# Altium schematic sheet BopIt.SchDoc
size A; SheetNumber: 1; SheetTotal: 1
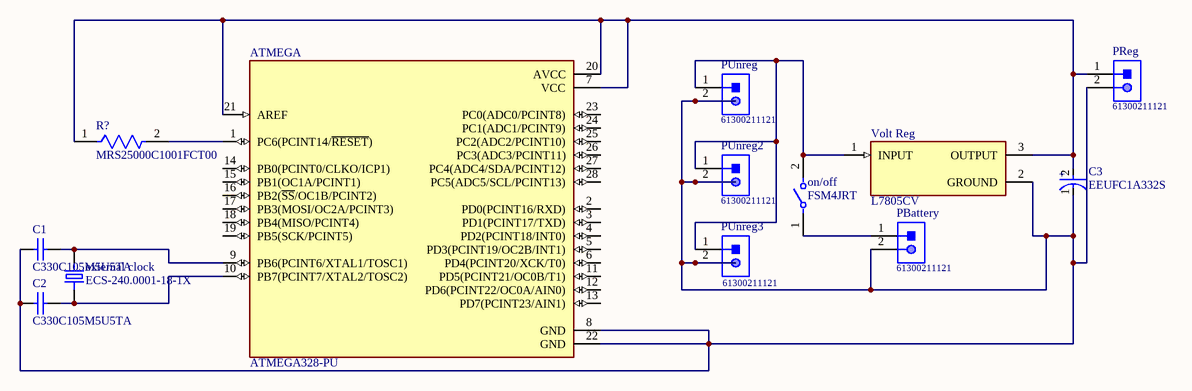
[diagram p0: BopIt.SchDoc]

## Parts
ATMEGA  ATMEGA328-PU  [DIP787W46P254L3467H508Q28]
C1  C330C105M5U5TA  [KEMT-C330C105M5U5TA]
C2  C330C105M5U5TA  [KEMT-C330C105M5U5TA]
C3  EEUFC1A332S  [FP-RAD-TH-D_16_0_5-L_20_2-MFG]
external_clock  ECS-240.0001-18-1X  [XTAL_ECS-200-20-1X]
on/off  FSM4JRT  [FP-FSM4JRT-MFG]
PBattery  61300211121  [61300211121]
PReg  61300211121  [61300211121]
PUnreg  61300211121  [61300211121]
PUnreg2  61300211121  [61300211121]
PUnreg3  61300211121  [61300211121]
R?  MRS25000C1001FCT00  [FP-MRS25-MFG]
Volt_Reg  L7805CV  [TO255P1040X460X1968-3]

## Nets
NetATMEGA_1: ATMEGA.1(PC6(PCINT14/~{RESET})) R?.2
NetATMEGA_7: ATMEGA.7(VCC) ATMEGA.20(AVCC) ATMEGA.21(AREF) C3.2(A) PReg.1 R?.1 Volt_Reg.3(OUTPUT)
NetATMEGA_8: ATMEGA.8(GND) ATMEGA.22(GND) C1.1 C2.1 C3.1(C) PBattery.2 PReg.2 PUnreg.2 PUnreg2.2 PUnreg3.2 Volt_Reg.2(GROUND)
NetATMEGA_9: ATMEGA.9(PB6(PCINT6/XTAL1/TOSC1)) C1.2 external_clock.2
NetATMEGA_10: ATMEGA.10(PB7(PCINT7/XTAL2/TOSC2)) C2.2 external_clock.1
Neton/off_1: on/off.1 PBattery.1
Neton/off_2: on/off.2 PUnreg.1 PUnreg2.1 PUnreg3.1 Volt_Reg.1(INPUT)

Not connected (* = marked no-connect by the designer): ATMEGA 2(PD0(PCINT16/RXD)) 3(PD1(PCINT17/TXD)) 4(PD2(PCINT18/INT0)) 5(PD3(PCINT19/OC2B/INT1)) 6(PD4(PCINT20/XCK/T0)) 11(PD5(PCINT21/OC0B/T1)) 12(PD6(PCINT22/OC0A/AIN0)) 13(PD7(PCINT23/AIN1)) 14(PB0(PCINT0/CLKO/ICP1)) 15(PB1(OC1A/PCINT1)) 16(PB2(~{SS}/OC1B/PCINT2)) 17(PB3(MOSI/OC2A/PCINT3)) 18(PB4(MISO/PCINT4)) 19(PB5(SCK/PCINT5)) 23(PC0(ADC0/PCINT8)) 24(PC1(ADC1/PCINT9)) 25(PC2(ADC2/PCINT10)) 26(PC3(ADC3/PCINT11)) 27(PC4(ADC4/SDA/PCINT12)) 28(PC5(ADC5/SCL/PCINT13))

## Notes on the sheet
- (in symbol CMP-05427-000988-1) +

## Library data of the parts
ATMEGA = ATMEGA328-PU: AVR AVRÂ® ATmega Microcontroller IC 8-Bit 20MHz 32KB (16K x 16) FLASH 28-PDIP; MF: Microchip Technology; Value: *; Package: DIP-28 Microchip Technology; Availability: In Stock; Check_prices: https://www.snapeda.com/parts/ATMEGA328-PU/Microchip/view-part/?ref=eda; SnapEDA_Link: https://www.snapeda.com/parts/ATMEGA328-PU/Microchip/view-part/?ref=snap; Purchase-URL: https://pricing.snapeda.com/search/part/ATMEGA328-PU/?ref=eda; MP: ATMEGA328-PU; Price: None
C1 C2 = CMP-2000-06056-1: Ceramic Capacitor, 1 uF, +/- 20%, 50 V, -10 to 85 degC, 2-Pin THD, RoHS, Bulk; Manufacturer: Kemet; Voltage - Rated: 50V; Temperature Coefficient: Z5U; Catalog Drawings: C330(std); Product Training Modules: CapacitorBasics-TypicalUsesforCapacitors; Capacitance: 1µF; Online Catalog: GoldenMax™Series; Other Names: 399-4390; PCN Design/Specification: C3yySeriesGoldenMaxLeadConfiguration02/Feb/2015; Thickness (Max): -; Size / Dimension: 0.300"Lx0.150"W(7.62mmx3.81mm); Mounting Technology: ThroughHole; Tolerance: ±20%; Mounting Type: ThroughHole; Datasheet URL: http://www.kemet.com/Lists/ProductCatalog/Attachments/599/KEM_C1051_GOLDMAX_Z5U.pdf; Series: GoldenMax™; Standard Package: 250; Ratings: -; Applications: GeneralPurpose; Package Reference: C330C105M5U5TA; Packaging: Bulk; Category: Capacitors; Package Description: 2-Pin Through Hole Device, Body 7.11 x 4.07 mm; Operating Temperature: 10°C~85°C; Height - Seated (Max): 0.360"(9.14mm); Manufacturer URL: http://www.kemet.com/; Lead Spacing: 0.200"(5.08mm); Features: -; Lead Style: Straight; Package / Case: Radial; Family: CeramicCapacitors; Datasheet Version: 12/2015
C3 = CMP-05427-000988-1: Aluminum Electrolytic Capacitors (Radial Lead Type) AEC-Q200 Qualified 3300uF ±20% 10V; Polarity: Polar; Capacitance: 3.3mF; Leakage Current: 3uA; Impedance: 29mR; Ripple Current: 2.205A; Lead Diameter: 0.8mm; Dissipation Factor: 0.19%; Life (Hours): 5000Hour; Voltage Rating: 10V; Mount: Through Hole; Series: FC; Lead Free: Lead Free; Max Operating Temperature: 105°C; Radiation Hardening: No; Lead Pitch: 7.5mm; Height: 20mm; Case/Package: Radial; Packaging: Bulk; Package Quantity: 100; Voltage Rating (DC): 10V; Diameter: 16mm; Length: 20mm; Min Operating Temperature: -55°C; Tolerance: 20%; RoHS Compliant: Yes; Construction: RADIAL; Voltage: 10V; ESR (Equivalent Series Resistance): 29mR; Termination: Radial; Height - Seated (Max): 0.787inch
external_clock = ECS-240.0001-18-1X: Crystals / Oscillators / Resonators 24.00014MHz 18pF; MF: ECS International; Package: HC49/U ECS International; Availability: Unavailable; Value: *; MP: ECS-240.0001-18-1X; Price: None; SnapEDA_Link: https://www.snapeda.com/parts/ECS-240.0001-18-1X/ECS%20International/view-part/259232/?ref=snap
on/off = CMP-03407-000038-1: SWITCH TACTILE SPST-NO 0.05A 24V; Current Rating: 50mA; Actuator Diameter: 3.5mm; Max Voltage Rating (DC): 12V; Actuator Length: 0.055inch; Switch Travel: 0.25mm; Actuator Type: Standard; Contact Resistance: 100mR; Illumination Type: Non-Illuminated; Electrical Life: 100000Cycles; Throw Configuration: SPST; Switch Function: Off-Mom; Actuator Material: Resin; Operating Force: 1.57N; Series: FSMJRT; Min Operating Temperature: -35°C; Max Current Rating: 50mA; Termination: PC Pins; Type: Switch; Radiation Hardening: No; Max Operating Temperature: 105°C; Voltage Rating (DC): 12V; Contact Material: Copper Alloy; Contact Current Rating: 50mA; RoHS Compliant: Yes; Mechanical Life: 100000Cycles; Mount: Through Hole; Package Quantity: 10000; Case/Package: Radial; Packaging: Tape and Reel; Length: 6.19mm; Contact Plating: Silver; Depth: 6.19mm; Orientation: Straight
PBattery PReg PUnreg PUnreg2 PUnreg3 = CMP-1712-00002-4: THT Vertical Pin Header WR-PHD, Pitch 2.54 mm, Single Row, 2 pins; Manufacturer: Wurth Elektronik; Rated Current: 3A; Gender: Male; Withstanding Voltage: 500VAC; Working Voltage: 250VAC; Pitch: 2.54mm; Contact Resistance: 20mOhm; Pin Number: 2; Mounting Technology: THT; Orientation: Vertical; Operating Temperature: -40to105degC; Packaging: Bag; Publisher: WurthElektronik; Datasheet URL: https://katalog.we-online.de/em/datasheet/6130xx11121.pdf; Manufacturer URL: http://www.we-online.de; Row Number: Single; Package Reference: 61300211121; Part Number: 61300211121
R? = CMP-02408-000051-1: RES 1K OHM 0.6W 1% AXIAL; Power Rating: 600mW; Lead Diameter: 0.6mm; Voltage Rating (DC): 350V; Resistance: 1kR; Temperature Coefficient: 50ppm/°C; Width: 2.5mm; Military Standard: Not; Package Quantity: 5000; Radiation Hardening: No; Case/Package: Axial; Resistance Tolerance: 1%; Resistor Type: Metal Film; Contact Plating: Tin; Length: 6.5mm; Lead Free: Lead Free; RoHS Compliant: Yes; Mount: Through Hole; Number of Pins: 2; Technology: THIN FILM; Voltage Rating: 350V; Min Operating Temperature: -55°C; Weight: 0.00776oz; Diameter: 2.5mm; Construction: Cylindrical; Series: MRS25; Tolerance: 1%; Packaging: Tape and Reel; Max Operating Temperature: 155°C; Max Power Dissipation: 600mW; Number of Terminations: 2; Termination: Axial
Volt_Reg = L7805CV: Linear Voltage Regulator IC Positive Fixed 1 Output 1.5A TO-220; MF: STMicroelectronics; SnapEDA_Link: https://www.snapeda.com/parts/L7805CV/STMicroelectronics/view-part/?ref=snap; Package: TO-220-3 ON Semiconductor; MP: L7805CV; Check_prices: https://www.snapeda.com/parts/L7805CV/STMicroelectronics/view-part/?ref=eda; Purchase-URL: https://pricing.snapeda.com/search/part/L7805CV/?ref=eda; Price: None; Value: *; Availability: In Stock